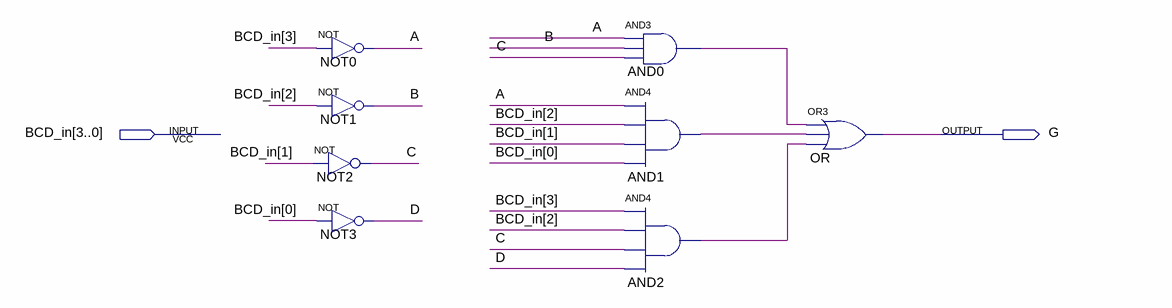
[diagram p0: schematic sheet]
// Quartus schematic DECOD_BCD_G.bdf as structural Verilog: 8 symbols, 2 pins
module DECOD_BCD_G (
  input  [3:0] BCD_in,
  output G
);

  wire A, AND0_out, AND1_out, AND2_out, B, C, D;

  not NOT0 (A, BCD_in[3]);
  not NOT1 (B, BCD_in[2]);
  not NOT2 (C, BCD_in[1]);
  not NOT3 (D, BCD_in[0]);
  and AND0 (AND0_out, A, B, C);
  and AND1 (AND1_out, A, BCD_in[2], BCD_in[1], BCD_in[0]);
  and AND2 (AND2_out, BCD_in[3], BCD_in[2], C, D);
  or OR (G, AND0_out, AND1_out, AND2_out);
endmodule
